# EAGLE design OS-MPS_Preamp_V2_OnlyINA (EAGLE 9.5.2)
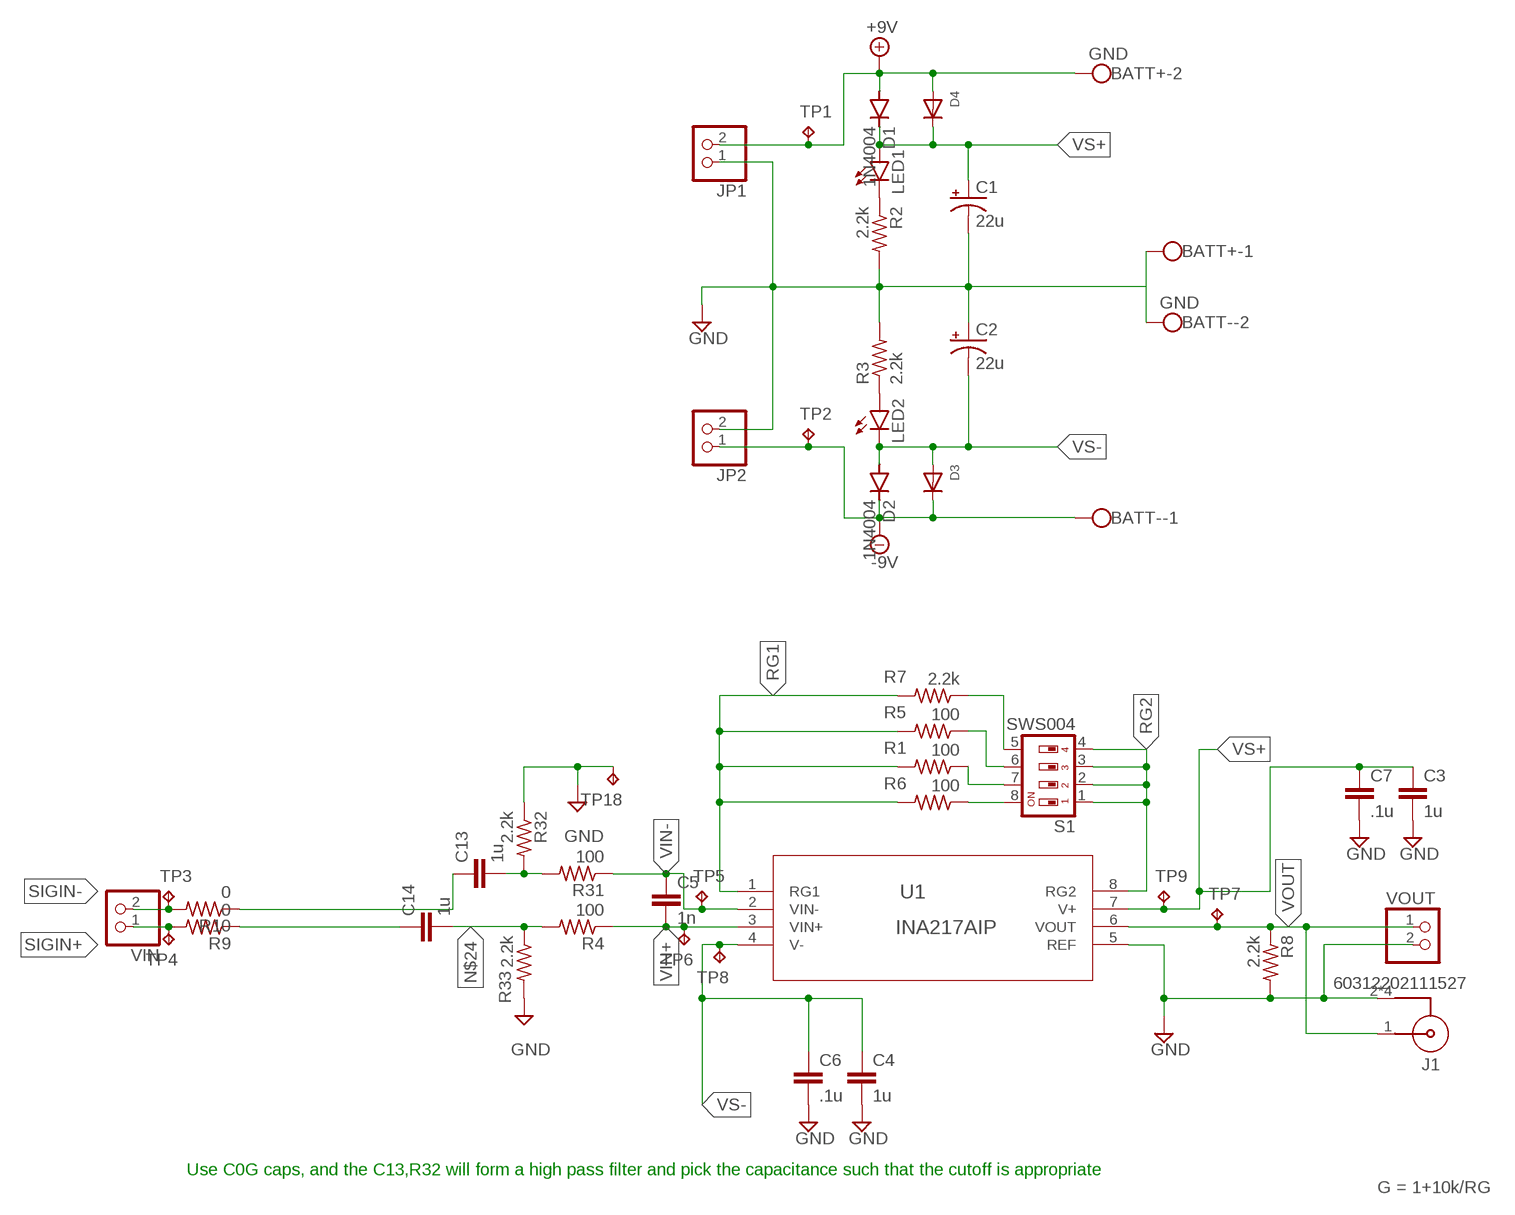
[diagram p0: schematic, sheet 1]

## Parts
BATT+  GND  W237-102  [W237-102]
BATT-  GND  W237-102  [W237-102]
C1  22u  CPOL-USTT2D6  [TT2D6]
C2  22u  CPOL-USTT2D6  [TT2D6]
C3  1u  C-EUC1206  [C1206]
C4  1u  C-EUC1206  [C1206]
C5  1n  C-EUC1206  [C1206]
C6  .1u  C-EUC1206  [C1206]
C7  .1u  C-EUC1206  [C1206]
C13  1u  C-EUC1206  [C1206]
C14  1u  C-EUC1206  [C1206]
D1  1N4004  [DO41-10]
D2  1N4004  [DO41-10]
D3  DIODESOD-123  [SOD-123]
D4  DIODESOD-123  [SOD-123]
J1  60312202111527  [60312202111527]
JP1  PINHD-1X2  [1X02]
JP2  PINHD-1X2  [1X02]
LED1  LEDSML0805  [SML0805]
LED2  LEDSML0805  [SML0805]
R1  100  R-US_R0805  [R0805]
R2  2.2k  R-US_R0805  [R0805]
R3  2.2k  R-US_R0805  [R0805]
R4  100  R-US_R0805  [R0805]
R5  100  R-US_R0805  [R0805]
R6  100  R-US_R0805  [R0805]
R7  2.2k  R-US_R0805  [R0805]
R8  2.2k  R-US_R0805  [R0805]
R9  0  R-US_R0805  [R0805]
R10  0  R-US_R0805  [R0805]
R31  100  R-US_R0805  [R0805]
R32  2.2k  R-US_R0805  [R0805]
R33  2.2k  R-US_R0805  [R0805]
S1  SWS004  [SMS-004]
TP1  TPB2,54  [B2,54]
TP2  TPB2,54  [B2,54]
TP3  TPTP20SQ  [TP20SQ]
TP4  TPTP20SQ  [TP20SQ]
TP5  TPTP20SQ  [TP20SQ]
TP6  TPTP20SQ  [TP20SQ]
TP7  TPTP20SQ  [TP20SQ]
TP8  TPTP20SQ  [TP20SQ]
TP9  TPTP20SQ  [TP20SQ]
TP18  TPTP20SQ  [TP20SQ]
U1  INA217AIP  [P8]
VIN  PINHD-1X2  [1X02]
VOUT  PINHD-1X2  [1X02]

## Nets
+9V: BATT+.2 D1.A D4.A JP1.2 TP1.TP
-9V: BATT-.1 D2.C D3.C JP2.1 TP2.TP
GND: BATT+.1 BATT-.2 C1.- C2.+ C3.2 C4.2 C6.2 C7.2 J1.2 J1.3 J1.4 J1.5 JP1.1 JP2.2 R2.2 R3.2 R8.2 R32.1 R33.2 TP18.TP U1.5(REF) VOUT.2
N$1: LED1.C R2.1
N$4: R5.1 S1.6
N$5: R1.1 S1.7
N$6: R6.1 S1.8
N$8: R7.1 S1.5
N$9: LED2.A R3.1
N$23: C13.1 R10.1
N$24: C14.2 R4.2 R33.1
N$26: C13.2 R31.2 R32.2
RG1: R1.2 R5.2 R6.2 R7.2 U1.1(RG1)
RG2: S1.1 S1.2 S1.3 S1.4 U1.8(RG2)
SIGIN+: R9.2 TP4.TP VIN.1
SIGIN-: R10.2 TP3.TP VIN.2
VIN+: C5.2 R4.1 TP6.TP U1.3(VIN+)
VIN+_1: C14.1 R9.1
VIN-: C5.1 R31.1 TP5.TP U1.2(VIN-)
VOUT: J1.1 R8.1 TP7.TP U1.6(VOUT) VOUT.1
VS+: C1.+ C3.1 C7.1 D1.C D4.C LED1.A TP9.TP U1.7(V+)
VS-: C2.- C4.1 C6.1 D2.A D3.A LED2.C TP8.TP U1.4(V-)

## Notes on the sheet
- Use C0G caps, and the C13,R32 will form a high pass filter and pick the capacitance such that the cutoff is appropriate
- G = 1+10k/RG

## Library data of the parts
BATT+ BATT- = Favorite_Parts:W237-102: WAGO SCREW CLAMP; MPN: 237-102; OC_FARNELL: unknown; OC_NEWARK: 70K9898
C1 C2 = Favorite_Parts:CPOL-US: POLARIZED CAPACITOR, American symbol; SPICEPREFIX: C
C3-C7 C13 C14 = Favorite_Parts:C-EU: CAPACITOR, European symbol; SPICEPREFIX: C
D1 D2 = diode:1N4004: DIODE general purpose rectifier, 1 A
D3 D4 = adafruit:DIODE: Diode SMADIODE - SMA Surface Mount Package 20V 1A Schottky Diode Digikey: 641-1014-6-ND DO-1N4148 - Through Hole Small Current Diode SOD-123 20V 1 A (.5mV Vf) Schottky Diode - Digikey: MBRX120TPMSCT-ND SOD-323 10V 570mA (.38mV Vf, 3ns) Schottky Diode - Digikey: ZLLS410CT-ND SOD-523 30V 30mA Schottky Diode (RB751S-40TE61) - Digikey: RB751S-40TE61CT-ND SOT23-R/W - SOT23 Package (R = Solder Paste/Reflow Ovens, W = Hand-Soldering) BAT54Film 40V 300mA - Digikey: 497-7162-1-ND
J1 = Wurth_Connectors_WR-SMA:60312202111527: WR-SMA SMA PCB End Launch Jack MATERIAL PROPERTIES Insulator Material PTFE Insulator Color White Center Contact Material Beryllium Copper Center Contact Plating Gold, min. 0.076µm over Nickel Body Material Brass Body Plating Gold, min. 0.076µm over Nickel KIND PROPERTIES Interface MIL-STD-348 Connector Type SMA Gender Jack Orientation Type Straight GENERAL INFORMATION Operating Temperature -65 up to +165 °C ELECTRICAL PROPERTIES Impedance 50 Ω Frequency Range DC~18 GHz MECHANICAL PROPERTIES Mating Cycle 500 Cycles PACKAGING PROPERTIES Packaging Tray <https://katalog.we-online.com/media/images/v2/o150655v209%20Family_WR-SMA_60312202111527.jpg> Details see: https://katalog.we-online.com/en/em/WR-SMA_603122X211XXXX Updated by Ella Wu 2019-11-07 2019 (C) Würth Elektronik; DATASHEET-URL: https://www.we-online.com/catalog/datasheet/60312202111527.pdf; GENDER: Jack; INTERFACE: MIL-STD-348; MOUNT: End Launch; ORIENTATION-TYPE: Straight; PART-NUMBER: 60312202111527; Z: 50Ohm
JP1 JP2 VIN VOUT = Favorite_Parts:PINHD-1X2: PIN HEADER
LED1 LED2 = Favorite_Parts:LED: LED OSRAM: - CHIPLED LG R971, LG N971, LY N971, LG Q971, LY Q971, LO R971, LY R971 LH N974, LH R974 LS Q976, LO Q976, LY Q976 LO Q996 - Hyper CHIPLED LW Q18S LB Q993, LB Q99A, LB R99A - SideLED LS A670, LO A670, LY A670, LG A670, LP A670 LB A673, LV A673, LT A673, LW A673 LH A674 LY A675 LS A676, LA A676, LO A676, LY A676, LW A676 LS A679, LY A679, LG A679 - Hyper Micro SIDELED® LS Y876, LA Y876, LO Y876, LY Y876 LT Y87S - SmartLED LW L88C, LW L88S LB L89C, LB L89S, LG L890 LS L89K, LO L89K, LY L89K LS L896, LA L896, LO L896, LY L896 - TOPLED LS T670, LO T670, LY T670, LG T670, LP T670 LSG T670, LSP T670, LSY T670, LOP T670, LYG T670 LG T671, LOG T671, LSG T671 LB T673, LV T673, LT T673, LW T673 LH T674 LS T676, LA T676, LO T676, LY T676, LB T676, LH T676, LSB T676, LW T676 LB T67C, LV T67C, LT T67C, LS T67K, LO T67K, LY T67K, LW E67C LS E67B, LA E67B, LO E67B, LY E67B, LB E67C, LV E67C, LT E67C LW T67C LS T679, LY T679, LG T679 LS T770, LO T770, LY T770, LG T770, LP T770 LB T773, LV T773, LT T773, LW T773 LH T774 LS E675, LA E675, LY E675, LS T675 LS T776, LA T776, LO T776, LY T776, LB T776 LHGB T686 LT T68C, LB T68C - Hyper Mini TOPLED® LB M676 - Mini TOPLED Santana® LG M470 LS M47K, LO M47K, LY M47K Source: http://www.osram.convergy.de LUXEON: - LUMILED® LXK2-PW12-R00, LXK2-PW12-S00, LXK2-PW14-U00, LXK2-PW14-V00 LXK2-PM12-R00, LXK2-PM12-S00, LXK2-PM14-U00 LXK2-PE12-Q00, LXK2-PE12-R00, LXK2-PE12-S00, LXK2-PE14-T00, LXK2-PE14-U00 LXK2-PB12-K00, LXK2-PB12-L00, LXK2-PB12-M00, LXK2-PB14-N00, LXK2-PB14-P00, LXK2-PB14-Q00 LXK2-PR12-L00, LXK2-PR12-M00, LXK2-PR14-Q00, LXK2-PR14-R00 LXK2-PD12-Q00, LXK2-PD12-R00, LXK2-PD12-S00 LXK2-PH12-R00, LXK2-PH12-S00 LXK2-PL12-P00, LXK2-PL12-Q00, LXK2-PL12-R00 Source: www.luxeon.com KINGBRIGHT: KA-3528ASYC Source: www.kingbright.com
R1-R10 R31-R33 = Favorite_Parts:R-US_: RESISTOR, American symbol; SPICEPREFIX: R
S1 = smd-special:SWS004: SMD Dip Switch 4 pol.
TP1-TP9 TP18 = Favorite_Parts:TP: Test pad
U1 = MyParts:INA217AIP: INA217 Low noise INA; DATASHEET_URL: http://www.ti.com/lit/gpn/INA217; DESCRIPTION: Low Noise, Low-Distortion Instrumentation Amplifier Replacement for SSM2017; FAMILY_NAME: SINGLE SUPPLY; GENERIC_PART_NUMBER: INA217; INDUSTRY_STD_PKG_TYPE: PDIP; MANUFACTURER: Texas Instruments; MANUFACTURER_PART_NUMBER: INA217AIP; PACKAGE_DESIGNATOR: P; PIN_COUNT: 8; VENDOR: Texas Instruments

## Board
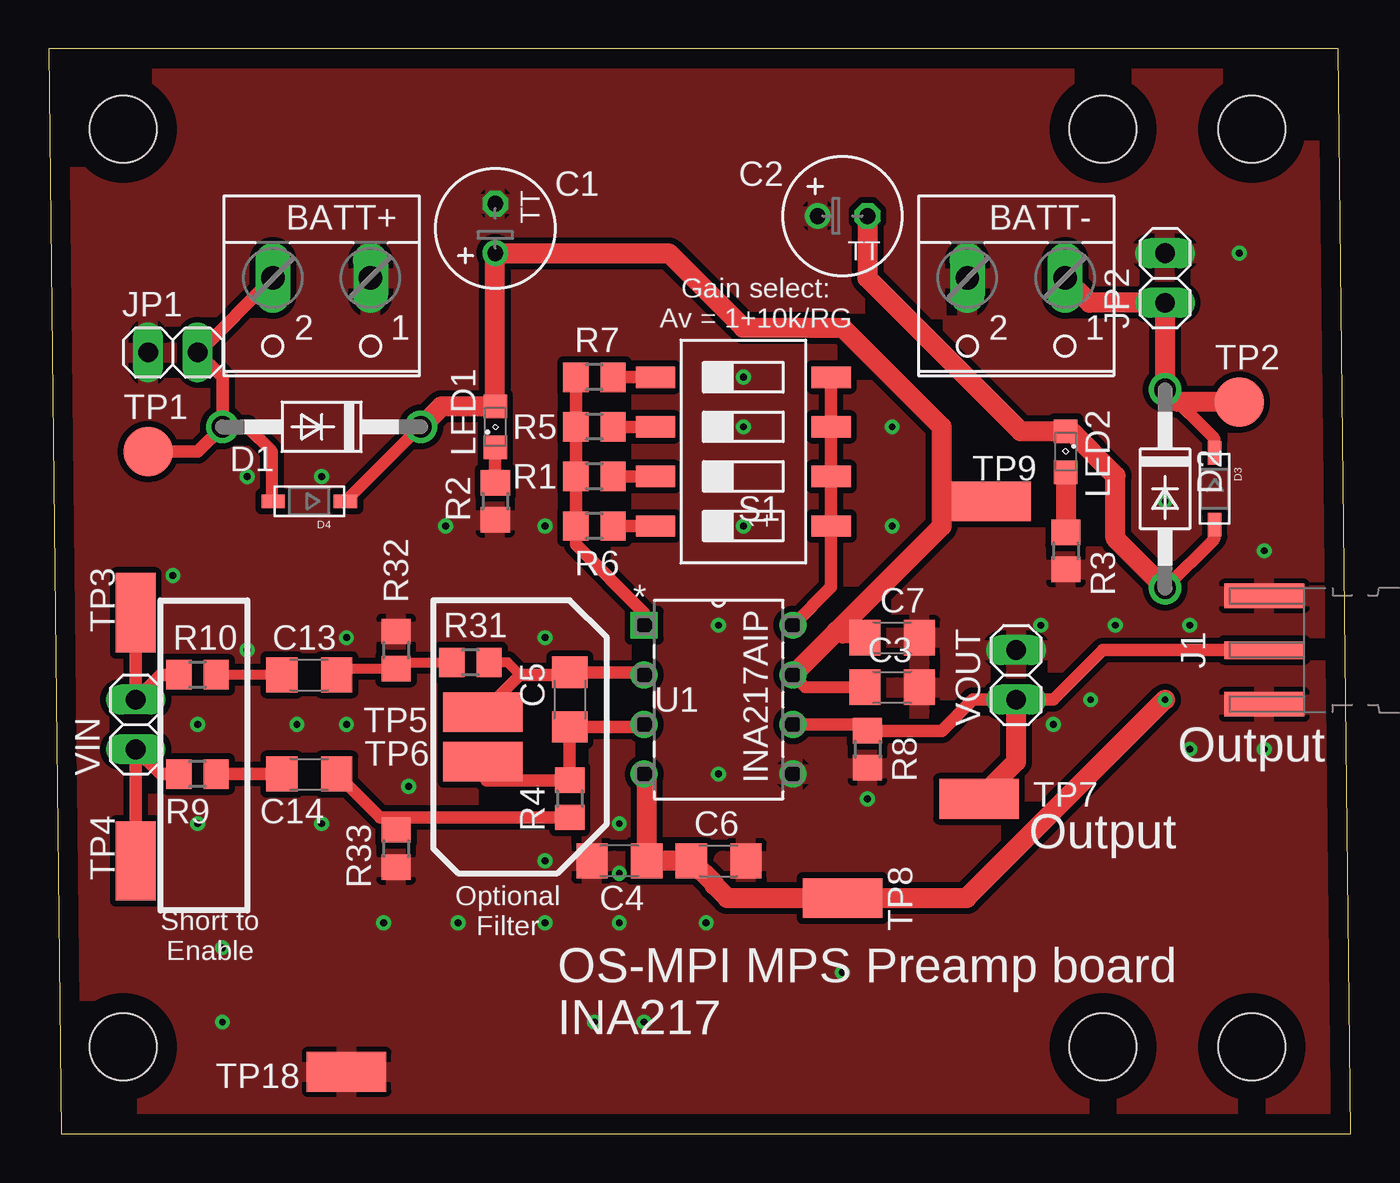
[diagram p1: board, top side]
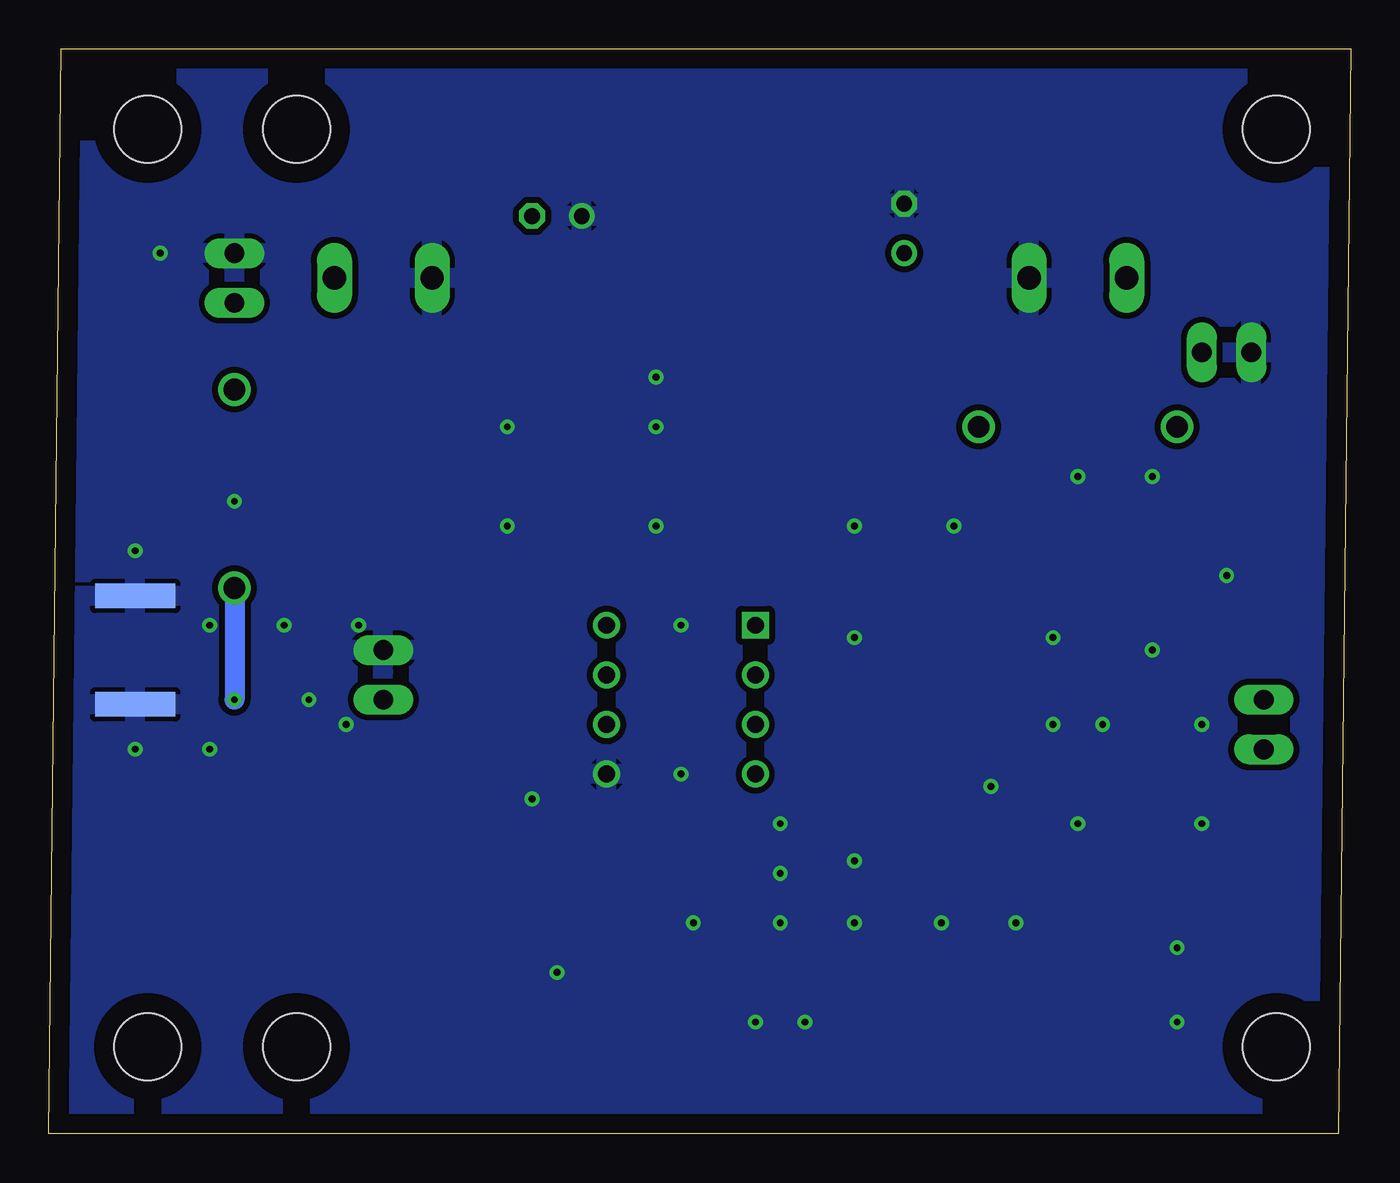
[diagram p2: board, bottom side, seen from below]

Size 66.66 x 55.55 mm. Coordinates in mm from the lower left corner, seen from the top.
Outline: 0.64,0 66.66,0 66.02,55.55 0,55.55 0.64,0
Copper layers (1*16): Top 0.035mm / dielectric 1.5mm / Bottom 0.035mm
Design rules "default *": minimum track width 6mil, minimum drill 0.35mm, track to track 12mil, track to pad 12mil, pad to pad 12mil, via to via 12mil, smd to smd 6mil, copper to edge 40mil, drill to drill 6mil, minimum pad ring 10mil, minimum via ring 8mil, stop-mask expansion 4mil, vias tented up to drill 0mil, thermal gap 10mil
Holes 3.43 mm at 3.81,51.43 61.59,51.43 3.81,4.45 61.59,4.45 53.98,4.45 53.98,51.43

### Footprints (pad centres in the part's own frame; a part is rotated, then mirrored left to right if it is on the bottom)
W237-102 = drill 1.194 long: 1 -2.5,-1.27; 2 2.5,-1.27
TT2D6 = drill 0.813: + -1.27,0 | drill 0.813 octagon: - 1.27,0
C1206 = smd 1.6 x 1.8: 1 -1.4,0; 2 1.4,0
DO41-10 = drill 1.118: A 5.08,0; C -5.08,0
SOD-123 = smd 1.2 x 0.7: A 1.85,0; C -1.85,0
60312202111527 = smd 0.9 x 4.1: 1 0,0 | smd 1.25 x 4.1: 2 -2.775,0; 3 2.775,0 | smd 1.25 x 4.1 bottom: 4 -2.775,0; 5 2.775,0
1X02 = drill 1.016 long: 1 -1.27,0; 2 1.27,0
SML0805 = smd 1.2 x 1.2: A 1.05,0; C -1.05,0
R0805 = smd 1.3 x 1.5: 1 -0.95,0; 2 0.95,0
SMS-004 = smd 1.092 x 2.007: 1 -3.81,-4.496; 2 -1.27,-4.496; 3 1.27,-4.496; 4 3.81,-4.496; 5 3.81,4.496; 6 1.27,4.496; 7 -1.27,4.496; 8 -3.81,4.496
B2,54 = smd 2.54 x 2.54: TP 0,0
TP20SQ = smd 4.064 x 2.032: TP 0,0
P8 = drill 0.864 pad 1.372 square: 1 -7.62,7.62 | drill 0.864 pad 1.372: 2 -7.62,5.08; 3 -7.62,2.54; 4 -7.62,0; 5 0,0; 6 0,2.54; 7 0,5.08; 8 0,7.62

### Placement (x,y rotation side)
BATT+  13.97,42.55 180 top
BATT-  49.53,42.55 180 top
C1  22.86,46.35 90 top
C2  40.64,46.99 0 top
C3  43.18,22.86 0 top
C4  29.21,13.97 180 top
C5  26.67,22.23 270 top
C6  34.29,13.97 0 top
C7  43.18,25.4 0 top
C13  13.34,23.49 0 top
C14  13.34,18.41 0 top
D1  13.97,36.2 180 top
D2  57.15,33.02 270 top
D3  59.69,33.02 270 top
D4  13.34,32.38 180 top
J1  62.23,24.77 90 top
JP1  6.35,40.01 0 top
JP2  57.15,43.81 90 top
LED1  22.86,36.2 90 top
LED2  52.07,34.93 270 top
R1  27.94,33.66 180 top
R2  22.86,32.38 270 top
R3  52.07,29.84 270 top
R4  26.67,17.15 270 top
R5  27.94,36.2 180 top
R6  27.94,31.12 180 top
R7  27.94,38.73 180 top
R8  41.91,19.69 270 top
R9  7.62,18.41 180 top
R10  7.62,23.49 180 top
R31  21.59,24.13 180 top
R32  17.78,24.77 270 top
R33  17.78,14.61 270 top
S1  35.56,34.93 90 top
TP1  5.08,34.93 0 top
TP2  60.96,37.47 0 top
TP3  4.45,26.67 90 top
TP4  4.45,13.97 90 top
TP5  22.23,21.59 180 top
TP6  22.23,19.05 0 top
TP7  47.62,17.15 180 top
TP8  40.64,12.07 180 top
TP9  48.26,32.38 0 top
TP18  15.24,3.18 0 top
U1  38.1,18.41 0 top
VIN  4.45,20.95 90 top
VOUT  49.53,23.49 90 top

### Tracks (layer width: path | path; a pad name or v marks a point on that pad's centre or on a via)
+9V
  Top 0.61: D4.A 11.43,32.44 11.43,34.93 10.16,36.2 D1.A
  Top 0.635: BATT+.2 7.66,40.01 JP1.2 8.89,38.73 D1.A 7.62,34.93 TP1.TP
-9V
  Top 0.61: D3.C 59.69,35.56 D2.C
  Top 1.016: TP2.TP 57.78,37.47 D2.C JP2.1 53.3,42.55 BATT-.1
GND  (via drill 0.35)
  other vias: 8.89,9.53 17.14,10.8 7.62,15.88 8.89,5.71 20.95,10.8 33.66,10.8 29.21,15.88 25.4,13.97 15.24,25.4 7.62,20.95 10.16,24.77 6.35,28.58 25.4,31.12 20.32,31.12 43.18,36.2 43.18,31.12 41.91,17.15 34.29,18.41 62.23,19.69 62.23,29.84 54.61,26.04 58.42,26.04 53.34,22.23 58.42,19.69 51.44,20.95 50.8,26.04 57.15,32.38 60.96,45.09 40.64,8.26 29.21,10.8 29.21,13.34 25.4,10.8 18.41,17.78 15.24,20.95 12.7,20.95 13.97,15.88 10.16,33.66 13.97,33.66 30.48,5.71 27.94,5.71 35.56,38.73 35.56,36.2 35.56,31.12 34.29,26.04 25.4,25.4
  pour Top: 0,59.69 0,0 66.04,0 66.04,59.69
  pour Bottom: 0,58.42 0,0 66.04,0 66.04,58.42
N$1
  Top 0.635: R2.1 LED1.C
N$4
  Top 0.635: R5.1 S1.6
N$5
  Top 0.635: R1.1 S1.7
N$6
  Top 0.635: R6.1 S1.8
N$8
  Top 0.635: R7.1 S1.5
N$9
  Top 1.016: LED2.A R3.1
N$23
  Top 0.508: C13.1 R10.1
N$24
  Top 0.508: R33.1 17.78,16.2
  Top 0.635: R4.2 17.78,16.2 16.95,16.2 C14.2
N$26
  Top 0.508: C13.2 15.05,23.81 R32.2 18.09,24.13 R31.2
RG1
  Top 0.635: U1.1 30.48,26.67 26.99,30.16 R6.2 R1.2 R5.2 R7.2
RG2
  Top 0.635: U1.8 40.06,27.99 S1.1 S1.2 S1.3 S1.4
SIGIN+
  Top 0.635: R9.2 5.71,18.41 VIN.1 TP4.TP
SIGIN-
  Top 0.635: R10.2 5.71,23.49 VIN.2 TP3.TP
VIN+
  Top 0.635: U1.3 30.35,20.83 C5.2 R4.1 22.41,18.09 TP6.TP
VIN+_1
  Top 0.635: R9.1 C14.1
VIN-
  Top 0.508: 24.13,23.49 23.5,24.13 R31.1
  Top 0.635: U1.2 30.35,23.62 C5.1 26.54,23.49 24.13,23.49 TP5.TP
VOUT
  Top 0.635: U1.6 41.59,20.95 R8.1 45.72,20.63 47.31,22.23 VOUT.1 | VOUT.1 51.44,22.23 53.98,24.77 J1.1 | VOUT.1 49.53,20.95
  Top 1.016: TP7.TP 49.53,19.05 VOUT.1
VS+
  Top 0.61: D4.C 19,36.2 D1.C | C7.1 40.64,25.4 40.32,25.72 | C3.1 38.73,22.86 U1.7
  Top 1.016: D1.C 20.1,37.24 LED1.A C1.+ 31.75,45.09 35.56,41.27 40.64,41.27 45.72,36.2 45.72,32.38 | U1.7 40.32,25.72 45.72,31.12 45.72,32.38 | TP9.TP 45.72,32.38
VS-  (via drill 0.35)
  Top 0.61: D2.A 59.69,30.48 D3.A
  Top 1.016: C2.- 41.91,43.81 49.75,35.98 LED2.C 52.32,35.98 54.61,33.68 54.61,30.48 D2.A | U1.4 30.61,18.29 C4.1 C6.1 34.08,12.78 34.08,12.73 34.75,12.07 TP8.TP 46.99,12.07 v57.15,22.23
  Bottom 1.016: D2.A v57.15,22.23

### Text on the board
tNames: Gain select: / Av = 1+10k/RG | Output | Output | Optional / Filter | Short to / Enable | OS-MPI MPS Preamp board / INA217